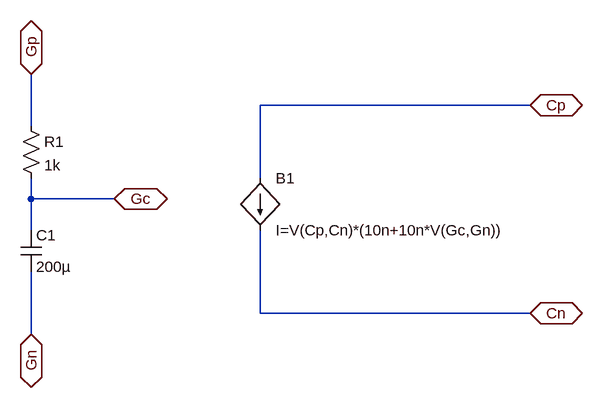
[diagram p0: schematic capteur_graphique.asc]
capteur_graphique.asc, the LTspice schematic file:
Version 4
SHEET 1 880 680
WIRE 464 16 48 16
WIRE -304 48 -304 -32
WIRE 48 128 48 16
WIRE -304 160 -304 128
WIRE -176 160 -304 160
WIRE -304 208 -304 160
WIRE 48 336 48 208
WIRE 464 336 48 336
WIRE -304 368 -304 272
FLAG 464 336 Cn
IOPIN 464 336 BiDir
FLAG 464 16 Cp
IOPIN 464 16 BiDir
FLAG -304 -32 Gp
IOPIN -304 -32 BiDir
FLAG -176 160 Gc
IOPIN -176 160 BiDir
FLAG -304 368 Gn
IOPIN -304 368 BiDir
SYMBOL bi 48 128 R0
SYMATTR InstName B1
SYMATTR Value I=V(Cp,Cn)*(10n+10n*V(Gc,Gn))
SYMBOL res -320 32 R0
SYMATTR InstName R1
SYMATTR Value 1k
SYMBOL cap -320 208 R0
SYMATTR InstName C1
SYMATTR Value 200µ

The netlist it stands for:
* capteur_graphique.asc
B1 Cp Cn I=V(Cp,Cn)*(10n+10n*V(Gc,Gn))
R1 Gp Gc 1k
C1 Gc Gn 200µ
.backanno
.end